# EAGLE design Down_Main_Board  (EAGLE 9.4.2)
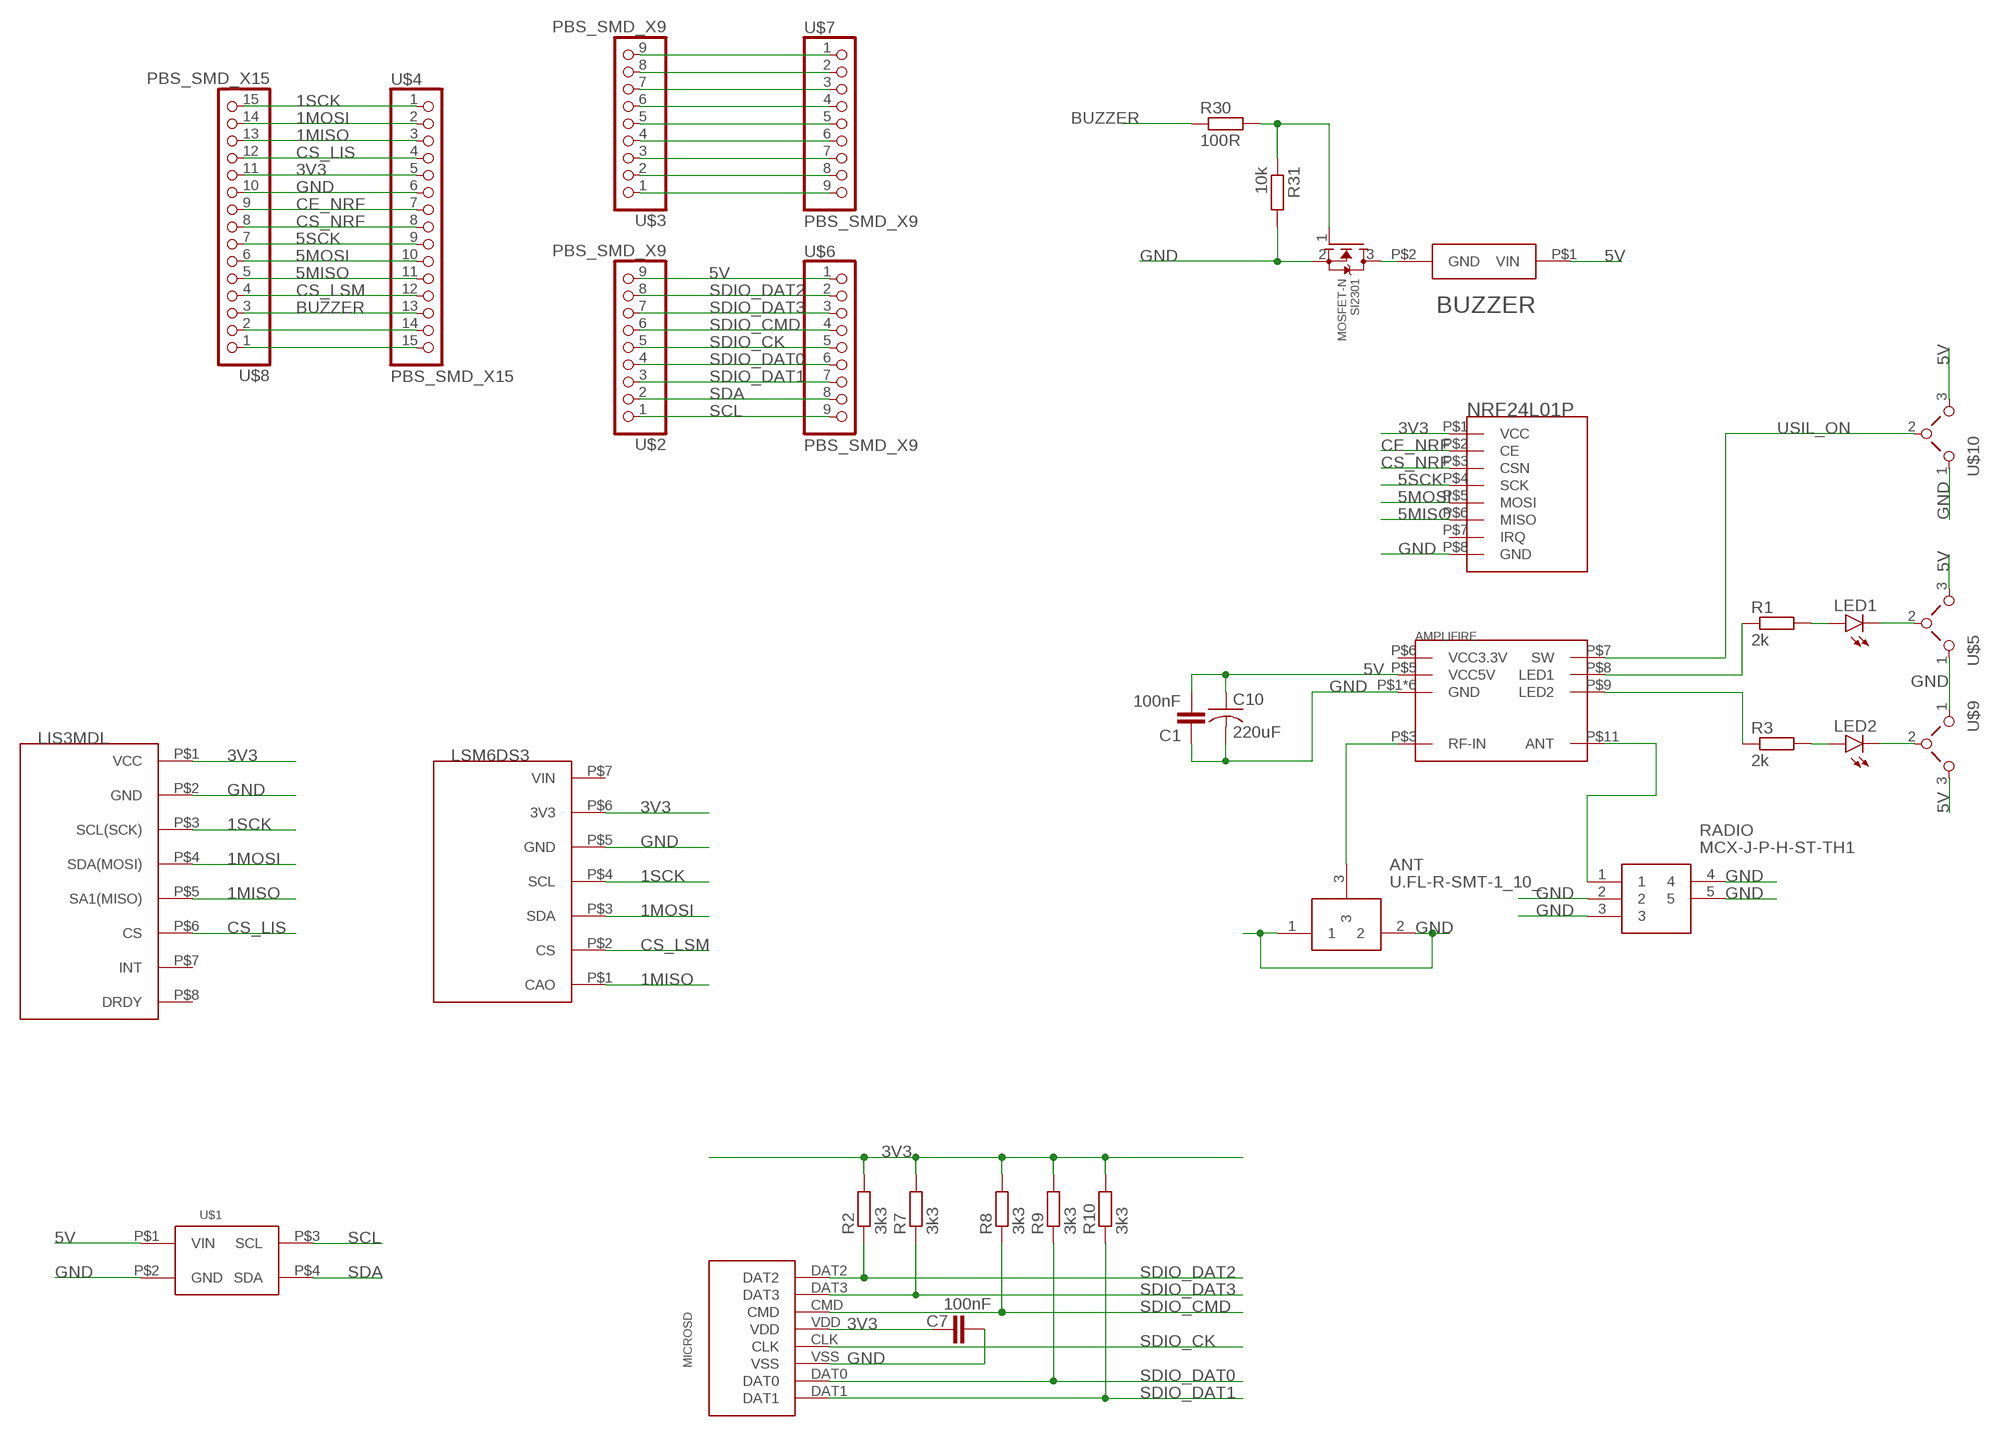
[diagram p0: schematic, sheet 1]

## Parts
AMPLIFIRE  XQ-02A  [XQ-02A]
ANT  U.FL-R-SMT-1_10_  [U.FL-R-SMT-1(10)]
BUZZER  BUZZERS8R6  [BUZZER-S8R12]
C1  100nF  C-EUC0603  [C0603]
C7  100nF  C-EUC0603  [C0603]
C10  220uF  ECAPECAP220  [ECAP220-CMD]
LED1  LEDCHIPLED_0603  [CHIPLED_0603]
LED2  LEDCHIPLED_0603  [CHIPLED_0603]
LIS3MDL  LIS3MDL-CJMCUбез_отв.  [LIS3MDL-CGMSU-NB2023-1]
LSM6DS3  LSM6DS3-GY-NB2023  [LSM6DS3-GY-NB2023]
MICROSD  SD  [SD]
NRF24L01P  NRF24L01_ML01SP4  [NRF24L01_ML01SP4]
R1  2k  R-EU_R0603  [R0603]
R2  3k3  R-EU_R0603  [R0603]
R3  2k  R-EU_R0603  [R0603]
R7  3k3  R-EU_R0603  [R0603]
R8  3k3  R-EU_R0603  [R0603]
R9  3k3  R-EU_R0603  [R0603]
R10  3k3  R-EU_R0603  [R0603]
R30  100R  R-EU_R0603  [R0603]
R31  10k  R-EU_R0603  [R0603]
RADIO  MCX-J-P-H-ST-TH1  [MCXJPHSTTH1]
SI2301  MOSFET-N  [SOT23-3]
U$1  BME280BME280-PINS-ONLY  [BME280-PINS-ONLY]
U$2  PBS_SMD_X9  [PBS_SMD_X9]
U$3  PBS_SMD_X9  [PBS_SMD_X9]
U$4  PBS_SMD_X15  [PBD_SMD_X15]
U$5  VIAS-SELECT  [VIAS-SELECT]
U$6  PBS_SMD_X9  [PBS_SMD_X9]
U$7  PBS_SMD_X9  [PBS_SMD_X9]
U$8  PBS_SMD_X15  [PBD_SMD_X15]
U$9  VIAS-SELECT  [VIAS-SELECT]
U$10  VIAS-SELECT  [VIAS-SELECT]

## Nets
1MISO: LIS3MDL.P$5(SA1(MISO)) LSM6DS3.P$1(CAO) U$4.3 U$8.13
1MOSI: LIS3MDL.P$4(SDA(MOSI)) LSM6DS3.P$3(SDA) U$4.2 U$8.14
1SCK: LIS3MDL.P$3(SCL(SCK)) LSM6DS3.P$4(SCL) U$4.1 U$8.15
3V3: C7.2 LIS3MDL.P$1(VCC) LSM6DS3.P$6(3V3) MICROSD.VDD NRF24L01P.P$1(VCC) R2.2 R7.2 R8.2 R9.2 R10.2 U$4.5 U$8.11
5MISO: NRF24L01P.P$6(MISO) U$4.11 U$8.5
5MOSI: NRF24L01P.P$5(MOSI) U$4.10 U$8.6
5SCK: NRF24L01P.P$4(SCK) U$4.9 U$8.7
5V: AMPLIFIRE.P$5(VCC5V) BUZZER.P$1(VIN) C1.2 C10.P$1 U$1.P$1(VIN) U$2.9 U$5.3(RIGHT) U$6.1 U$9.3(RIGHT) U$10.3(RIGHT)
BUZZER: R30.1 U$4.13 U$8.3
CE_NRF: NRF24L01P.P$2(CE) U$4.7 U$8.9
CS_LIS: LIS3MDL.P$6(CS) U$4.4 U$8.12
CS_LSM: LSM6DS3.P$2(CS) U$4.12 U$8.4
CS_NRF: NRF24L01P.P$3(CSN) U$4.8 U$8.8
GND: AMPLIFIRE.P$1(GND) AMPLIFIRE.P$2(GND) AMPLIFIRE.P$4(GND) AMPLIFIRE.P$10(GND) AMPLIFIRE.P$12(GND) AMPLIFIRE.P$13(GND) ANT.1 ANT.2 C1.1 C7.1 C10.P$2 LIS3MDL.P$2(GND) LSM6DS3.P$5(GND) MICROSD.VSS NRF24L01P.P$8(GND) R31.2 RADIO.2 RADIO.3 RADIO.4 RADIO.5 SI2301.2(S) U$1.P$2(GND) U$4.6 U$5.1(LEFT) U$8.10 U$9.1(LEFT) U$10.1(LEFT)
N$1: R30.2 R31.1 SI2301.1(G)
N$2: U$4.14 U$8.2
N$3: U$4.15 U$8.1
N$4: AMPLIFIRE.P$3(RF-IN) ANT.3
N$5: AMPLIFIRE.P$11(ANT) RADIO.1
N$6: U$3.8 U$7.2
N$7: U$3.7 U$7.3
N$8: U$3.6 U$7.4
N$9: U$3.5 U$7.5
N$10: U$3.4 U$7.6
N$11: U$3.3 U$7.7
N$12: U$3.9 U$7.1
N$14: U$3.2 U$7.8
N$15: U$3.1 U$7.9
N$16: LED1.C U$5.2(TOP)
N$17: LED1.A R1.2
N$18: AMPLIFIRE.P$8(LED1) R1.1
N$19: LED2.C U$9.2(TOP)
N$20: BUZZER.P$2(GND) SI2301.3(D)
N$21: LED2.A R3.2
N$22: AMPLIFIRE.P$9(LED2) R3.1
SCL: U$1.P$3(SCL) U$2.1 U$6.9
SDA: U$1.P$4(SDA) U$2.2 U$6.8
SDIO_CK: MICROSD.CLK U$2.5 U$6.5
SDIO_CMD: MICROSD.CMD R8.1 U$2.6 U$6.4
SDIO_DAT0: MICROSD.DAT0 R9.1 U$2.4 U$6.6
SDIO_DAT1: MICROSD.DAT1 R10.1 U$2.3 U$6.7
SDIO_DAT2: MICROSD.DAT2 R2.1 U$2.8 U$6.2
SDIO_DAT3: MICROSD.DAT3 R7.1 U$2.7 U$6.3
USIL_ON: AMPLIFIRE.P$7(SW) U$10.2(TOP)
Unconnected: AMPLIFIRE.P$6(VCC3.3V) LIS3MDL.P$7(INT) LIS3MDL.P$8(DRDY) LSM6DS3.P$7(VIN) NRF24L01P.P$7(IRQ)

## Library data of the parts
AMPLIFIRE = NEON-BLADE-2023:XQ-02A
ANT = U.FL-R-SMT-1_10_:U.FL-R-SMT-1_10_: UFL SMT PCB receptable,DC-6GHz Hirose Straight 50 Surface Mount UFL Connector, Receptacle, Solder Termination Coaxial Source: Datasheet <https://www.hirose.com/product/document?clcode=CL0331-0472-2-10&productname=U.FL-R-SMT-1(10)&series=U.FL&documenttype=2DDrawing&lang=en&documentid=0000940684>; ARROW_PART_NUMBER: U.FL-R-SMT-1(10); ARROW_PRICE-STOCK: https://www.arrow.com/en/products/u.fl-r-smt-1-10/hirose-electric; DESCRIPTION: UFL SMT PCB receptable,DC-6GHz Hirose Straight 50 Surface Mount UFL Connector, Receptacle, Solder Termination Coaxial; HEIGHT: mm; MANUFACTURER_NAME: Hirose; MANUFACTURER_PART_NUMBER: U.FL-R-SMT-1(10); MOUSER_PART_NUMBER: 798-U.FL-R-SMT-110; MOUSER_PRICE-STOCK: https://www.mouser.co.uk/ProductDetail/Hirose-Connector/U.FL-R-SMT-110?qs=kL1ClTr6oBoOdtqlGQpQrQ%3D%3D
BUZZER = NEON-BLADE-2023:BUZZER
C1 C7 = rcl:C-EU: CAPACITOR, European symbol; SPICEPREFIX: C
C10 = NEON-BLADE-2023:ECAP
LED1 LED2 = led:LED: LED OSRAM: - CHIPLED LG R971, LG N971, LY N971, LG Q971, LY Q971, LO R971, LY R971 LH N974, LH R974 LS Q976, LO Q976, LY Q976 LO Q996 - Hyper CHIPLED LW Q18S LB Q993, LB Q99A, LB R99A - SideLED LS A670, LO A670, LY A670, LG A670, LP A670 LB A673, LV A673, LT A673, LW A673 LH A674 LY A675 LS A676, LA A676, LO A676, LY A676, LW A676 LS A679, LY A679, LG A679 - Hyper Micro SIDELED® LS Y876, LA Y876, LO Y876, LY Y876 LT Y87S - SmartLED LW L88C, LW L88S LB L89C, LB L89S, LG L890 LS L89K, LO L89K, LY L89K LS L896, LA L896, LO L896, LY L896 - TOPLED LS T670, LO T670, LY T670, LG T670, LP T670 LSG T670, LSP T670, LSY T670, LOP T670, LYG T670 LG T671, LOG T671, LSG T671 LB T673, LV T673, LT T673, LW T673 LH T674 LS T676, LA T676, LO T676, LY T676, LB T676, LH T676, LSB T676, LW T676 LB T67C, LV T67C, LT T67C, LS T67K, LO T67K, LY T67K, LW E67C LS E67B, LA E67B, LO E67B, LY E67B, LB E67C, LV E67C, LT E67C LW T67C LS T679, LY T679, LG T679 LS T770, LO T770, LY T770, LG T770, LP T770 LB T773, LV T773, LT T773, LW T773 LH T774 LS E675, LA E675, LY E675, LS T675 LS T776, LA T776, LO T776, LY T776, LB T776 LHGB T686 LT T68C, LB T68C - Hyper Mini TOPLED® LB M676 - Mini TOPLED Santana® LG M470 LS M47K, LO M47K, LY M47K Source: http://www.osram.convergy.de LUXEON: - LUMILED® LXK2-PW12-R00, LXK2-PW12-S00, LXK2-PW14-U00, LXK2-PW14-V00 LXK2-PM12-R00, LXK2-PM12-S00, LXK2-PM14-U00 LXK2-PE12-Q00, LXK2-PE12-R00, LXK2-PE12-S00, LXK2-PE14-T00, LXK2-PE14-U00 LXK2-PB12-K00, LXK2-PB12-L00, LXK2-PB12-M00, LXK2-PB14-N00, LXK2-PB14-P00, LXK2-PB14-Q00 LXK2-PR12-L00, LXK2-PR12-M00, LXK2-PR14-Q00, LXK2-PR14-R00 LXK2-PD12-Q00, LXK2-PD12-R00, LXK2-PD12-S00 LXK2-PH12-R00, LXK2-PH12-S00 LXK2-PL12-P00, LXK2-PL12-Q00, LXK2-PL12-R00 Source: www.luxeon.com KINGBRIGHT: KA-3528ASYC Source: www.kingbright.com
LIS3MDL = NEON-BLADE-2023:LIS3MDL-CJMCU
LSM6DS3 = NEON-BLADE-2023:LSM6DS3-GY-NB2023
MICROSD = NEON-BLADE-2023:SD
NRF24L01P = NEON-BLADE-2023:NRF24L01_ML01SP4
R1-R3 R7-R10 R30 R31 = rcl:R-EU_: RESISTOR, European symbol; SPICEPREFIX: R
RADIO = MCX-J-P-H-ST-TH1:MCX-J-P-H-ST-TH1: Samtec MCXSeries, Through Hole MCX Jack jack, 50 Impedance, Solder Termination, 0 6GHz, Coaxial cable type Source: Datasheet <http://suddendocs.samtec.com/prints/mcx-j-p-x-st-th1-mkt.pdf>; ARROW_PART_NUMBER: MCX-J-P-H-ST-TH1; ARROW_PRICE-STOCK: https://www.arrow.com/en/products/mcx-j-p-h-st-th1/samtec?region=nac; DESCRIPTION: Samtec MCXSeries, Through Hole MCX Jack jack, 50 Impedance, Solder Termination, 0 6GHz, Coaxial cable type; HEIGHT: 5.81mm; MANUFACTURER_NAME: SAMTEC; MANUFACTURER_PART_NUMBER: MCX-J-P-H-ST-TH1; MOUSER_PART_NUMBER: 200-MCXJPHSTTH1; MOUSER_PRICE-STOCK: https://www.mouser.co.uk/ProductDetail/Samtec/MCX-J-P-H-ST-TH1?qs=Cqqh%252BS766wnNti0C6DXzpQ%3D%3D
SI2301 = NEON-BLADE-2023:MOSFET-N
U$1 = NEON-BLADE-2024:BME280
U$2 U$3 U$6 U$7 = NEON-BLADE-2024:PBS_SMD_X9
U$4 U$8 = NEON-BLADE-2024:PBS_SMD_X15
U$5 U$9 U$10 = NEON-BLADE-2024:VIAS-SELECT

## Board
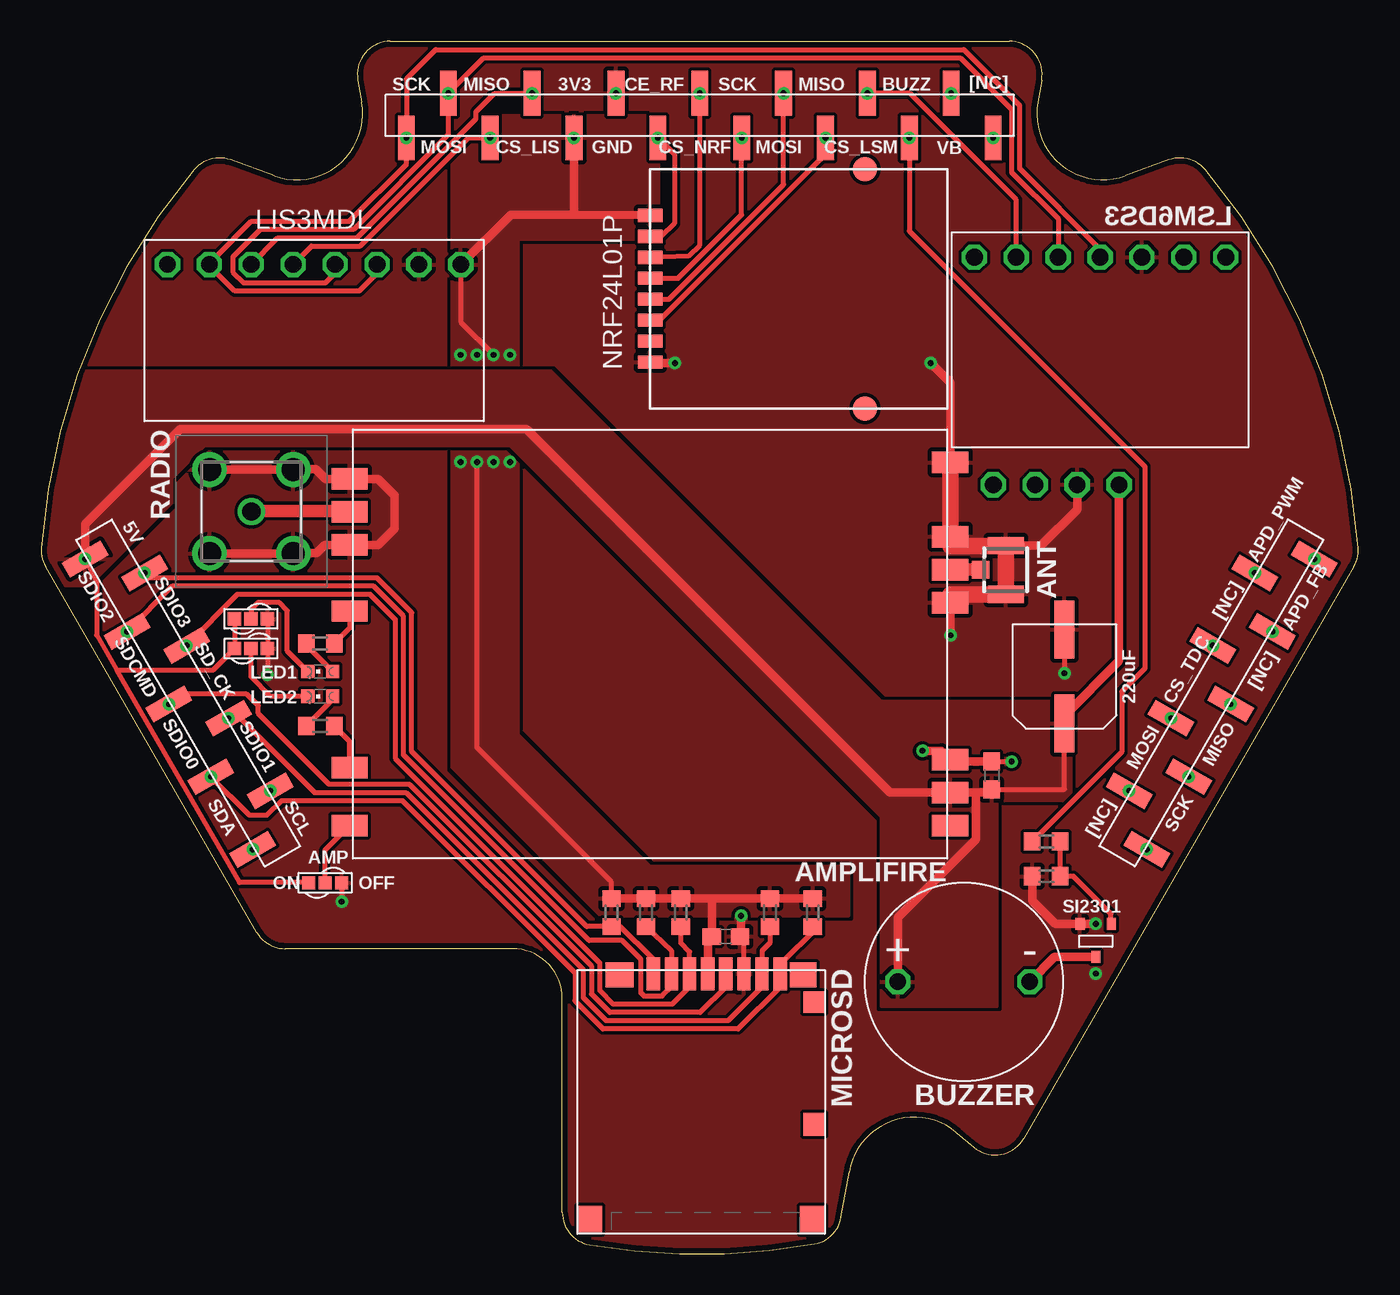
[diagram p1: board, top side]
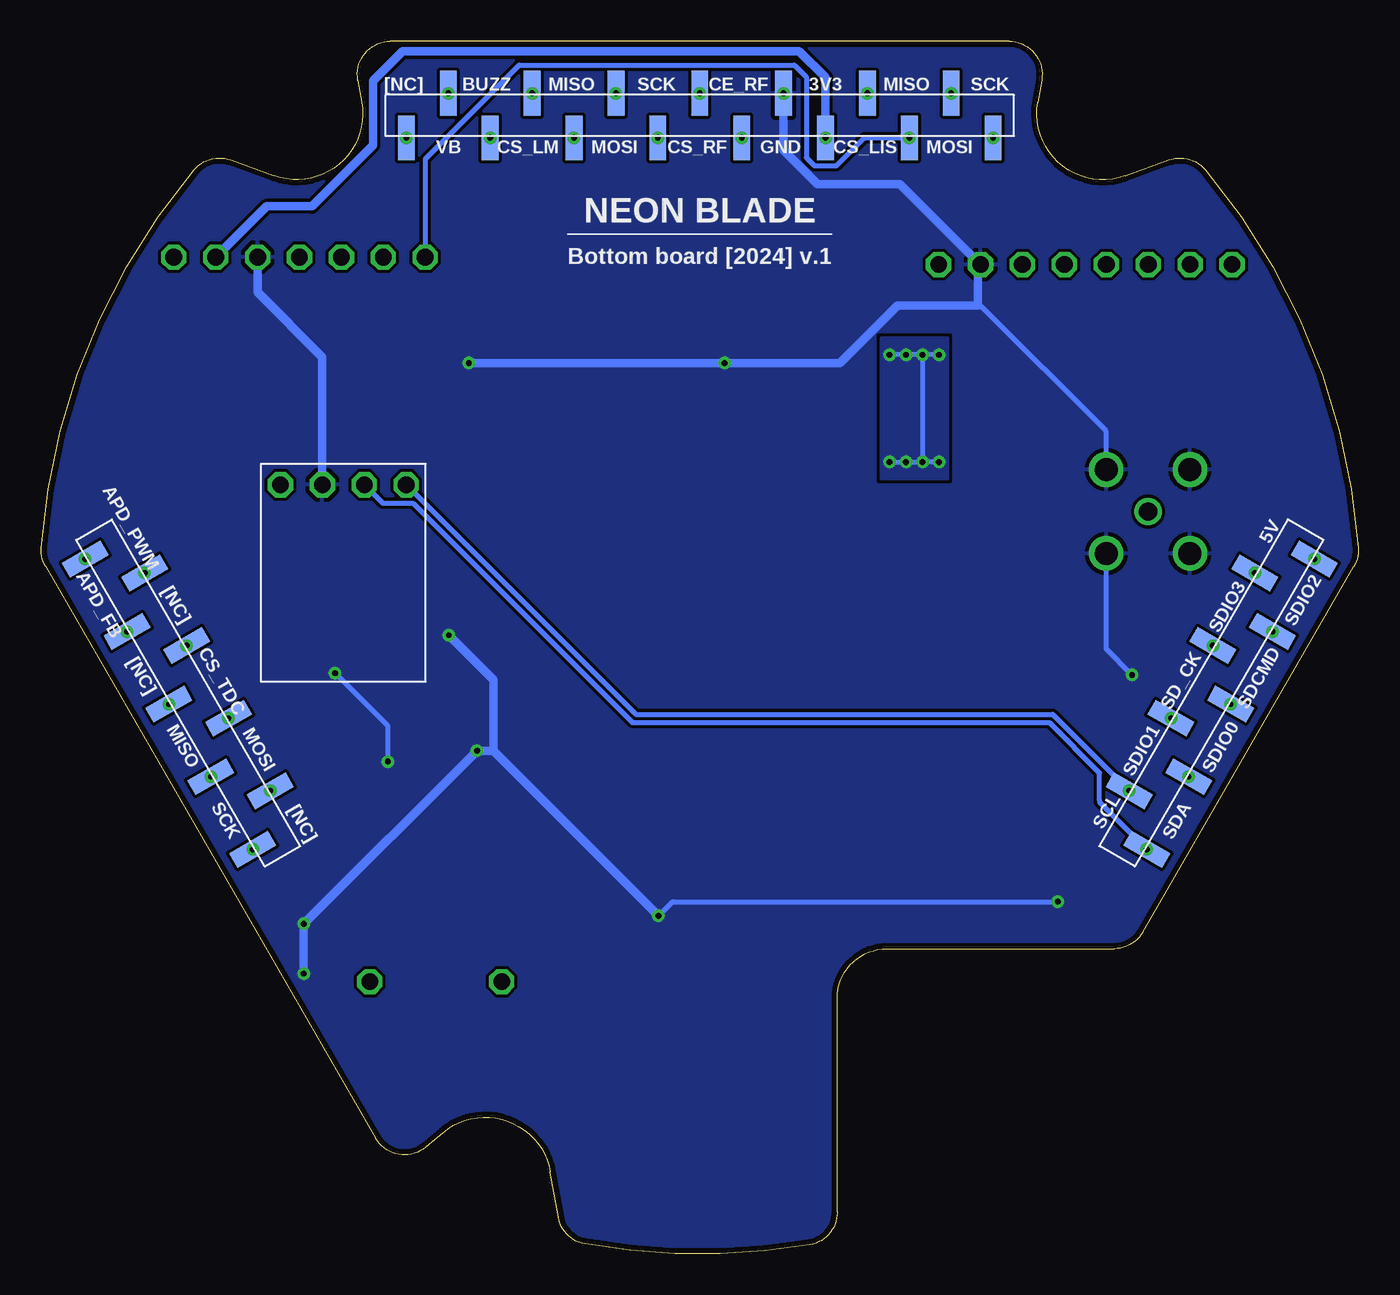
[diagram p2: board, bottom side, seen from below]

Size 79.81 x 73.48 mm. Coordinates in mm from the lower left corner, seen from the top.
Outline: 13.06,19.48 0.27,41.64 arc-34 0,42.78 arc-36 9.27,65.7 arc-70 11.48,66.29 14.11,65.33 arc120 19.42,69.79 19.18,71.13 arc-100 21.15,73.48 58.66,73.48 arc-100 60.63,71.13 60.39,69.79 arc120 65.7,65.33 68.33,66.29 arc-70 70.55,65.7 arc-36 79.81,42.78 arc-34 79.55,41.64 59.54,6.99 arc-100 56.52,6.46 55.47,7.34 arc120 48.96,4.97 48.48,2.21 arc-70 46.86,0.59 arc-20 33.24,0.54 arc-80 31.57,2.51 31.57,15.48 arc90 28.57,18.48 14.79,18.48 arc-60 13.06,19.48
Copper layers (1*16): Top 0.035mm / dielectric 1.5mm / Bottom 0.035mm
Design rules "default *": minimum track width 0.3mm, minimum drill 0.35mm, track to track 0.2mm, track to pad 0.2mm, pad to pad 0.2mm, via to via 0.2mm, smd to smd 0.2mm, copper to edge 0.35mm, drill to drill 0.00508125mm, minimum pad ring 10mil, minimum via ring 8mil, stop-mask expansion 4mil, vias tented up to drill 0mil, thermal gap 10mil

### Footprints (pad centres in the part's own frame; a part is rotated, then mirrored left to right if it is on the bottom)
XQ-02A = smd 2.2 x 1.3: P$1 -18.2,-11; P$2 -18.2,-6.5; P$3 -18.2,-4.5; P$4 -18.2,-2.5; P$5 -18.2,9; P$6 -18.2,11; P$7 18.2,11; P$8 18.2,7.5; P$9 18.2,-2; P$10 18.2,-6; P$11 18.2,-8; P$12 18.2,-10; P$13 -18.2,7
U.FL-R-SMT-1(10) = smd 1.05 x 2.2: 1 -1.475,0; 2 1.475,0 | smd 1.05 x 1.05: 3 0,1.525
BUZZER-S8R12 = drill 1 octagon: P$1 -4,0; P$2 4,0
C0603 = smd 1.1 x 1: 1 -0.85,0; 2 0.85,0
ECAP220-CMD = smd 1.2 x 3.5: P$1 0,2.85; P$2 0,-2.85
CHIPLED_0603 = smd 0.8 x 0.8: A 0,-0.75; C 0,0.75
LIS3MDL-CGMSU-NB2023-1 = drill 1.016 octagon: P$1 -8.89,-4; P$2 -6.35,-4; P$3 -3.81,-4; P$4 -1.27,-4; P$5 1.27,-4; P$6 3.81,-4; P$7 6.35,-4; P$8 8.89,-4
LSM6DS3-GY-NB2023 = drill 1.016 octagon: P$1 -7.62,-5; P$2 -5.08,-5; P$3 -2.54,-5; P$4 0,-5; P$5 2.54,-5; P$6 5.08,-5; P$7 7.62,-5
SD = smd 0.8 x 2: CLK 6,-15.77; CMD 8.2,-15.77; DAT0 3.8,-15.77; DAT1 2.7,-15.77; DAT2 10.4,-15.77; DAT3 9.3,-15.77; VDD 7.1,-15.77; VSS 4.9,-15.77 | smd 1.5 x 1.7: P$9 0.75,-0.85; P$13 14.25,-0.85 | smd 1.6 x 1.5: P$10 1.3,-15.7 | smd 1.29 x 1.3: P$11 0.645,-14.05 | smd 1.29 x 1.4: P$12 0.645,-6.65 | smd 1.7 x 1.5: P$14 12.45,-15.7
NRF24L01_ML01SP4 = smd 1.5 x 0.8: P$1 -9,4.445; P$2 -9,3.175; P$3 -9,1.905; P$4 -9,0.635; P$5 -9,-0.635; P$6 -9,-1.905; P$7 -9,-3.175; P$8 -9,-4.445 | smd 1.5 x 1.5: P$9 4,7.25; P$10 4,-7.25
R0603 = smd 1 x 1.1: 1 -0.85,0; 2 0.85,0
MCXJPHSTTH1 = drill 1.1 pad 1.65: 1 0,0 | drill 1.4 pad 2.1: 2 -2.54,2.54; 3 -2.54,-2.54; 4 2.54,-2.54; 5 2.54,2.54
SOT23-3 = smd 0.56 x 0.73: 1 -0.95,-1; 2 0.95,-1; 3 0,1
BME280-PINS-ONLY = drill 1.016 octagon: P$1 -3.81,5.33; P$2 -1.27,5.33; P$3 1.27,5.33; P$4 3.81,5.33
PBS_SMD_X9 = smd 1.02 x 2.7: 1 -10.16,1.35; 2 -7.62,-1.35; 3 -5.08,1.35; 4 -2.54,-1.35; 5 0,1.35; 6 2.54,-1.35; 7 5.08,1.35; 8 7.62,-1.35; 9 10.16,1.35
PBD_SMD_X15 = smd 1.02 x 2.7: 1 -17.78,1.35; 2 -15.24,-1.35; 3 -12.7,1.35; 4 -10.16,-1.35; 5 -7.62,1.35; 6 -5.08,-1.35; 7 -2.54,1.35; 8 0,-1.35; 9 2.54,1.35; 10 5.08,-1.35; 11 7.62,1.35; 12 10.16,-1.35; 13 12.7,1.35; 14 15.24,-1.35; 15 17.78,1.35
VIAS-SELECT = smd 0.8 x 0.8: 1 -0.5,0; 2 0.5,0; 3 1.5,0

### Placement (x,y rotation side)
AMPLIFIRE  36.89,36.95 180 top
ANT  58.46,41.44 90 top
BUZZER  55.91,16.48 0 top
C1  57.61,28.99 270 top
C7  41.49,19.23 180 top
C10  62.01,34.98 180 top
LED1  16.91,33.78 90 top
LED2  16.91,35.28 90 top
LIS3MDL  16.54,55.95 180 top
LSM6DS3  64.17,55.39 180 bottom
MICROSD  47.49,1.2 180 top
NRF24L01P  45.91,58.48 0 top
R1  16.91,31.98 180 top
R2  34.56,20.68 90 top
R3  16.91,36.98 180 top
R7  36.66,20.68 90 top
R8  38.76,20.68 90 top
R9  44.16,20.68 90 top
R10  46.76,20.68 90 top
R30  60.91,24.98 0 top
R31  60.91,22.88 180 top
RADIO  12.74,44.98 0 top
SI2301  63.91,18.98 180 top
U$1  61.51,41.27 0 bottom
U$2  8.91,33.98 120 top
U$3  70.91,33.98 240 top
U$4  39.91,68.98 180 bottom
U$5  13.21,36.68 180 top
U$6  8.91,33.98 240 bottom
U$7  70.91,33.98 120 bottom
U$8  39.91,68.98 180 top
U$9  13.21,38.48 180 top
U$10  17.71,22.48 180 top

### Tracks (layer width: path | path; a pad name or v marks a point on that pad's centre or on a via)
1MISO  (via drill 0.35)
  Top 0.3: U$8.13 25.91,67.63 19.34,61.06 16.38,61.06 LIS3MDL.P$5
  Bottom 0.3: LSM6DS3.P$1 56.55,66.34 50.86,72.03 34.17,72.03 33.45,71.31 33.45,66.44 32.94,65.93 31.63,65.93 29.93,67.63 U$8.13
  other vias: 27.21,67.63
1MOSI  (via drill 0.35)
  Top 0.3: LSM6DS3.P$3 61.63,62.72 58.81,65.54 58.81,69.37 55.7,72.48 26.82,72.48 U$8.14 24.67,67.81 18.92,62.06 13.27,62.06 11.61,60.41 11.61,59.49 12.27,58.84 17.23,58.84 17.81,59.42 LIS3MDL.P$4
  other vias: 24.67,70.33
1SCK  (via drill 0.35)
  Top 0.3: LSM6DS3.P$4 64.17,60.89 59.31,65.75 59.31,69.58 55.91,72.98 23.91,72.98 22.13,71.2 U$8.15 22.13,66.03 18.66,62.56 12.73,62.56 10.57,60.41 10.57,59.49 11.73,58.34 19.27,58.34 20.35,59.42 LIS3MDL.P$3
  other vias: 22.13,67.63
3V3  (via drill 0.35)
  Top 0.3: LIS3MDL.P$1 25.43,56.46 v27.41,54.48 | R2.2 34.56,22.53 26.41,30.68 v26.41,47.98
  Top 0.5: MICROSD.VDD 40.41,16.99 40.41,18.98 40.64,19.21 C7.2 40.64,21.26 arc-90 40.91,21.53 | LIS3MDL.P$1 28.46,62.99 32.29,62.99 | 32.29,62.99 NRF24L01P.P$1 | U$8.11 32.29,62.99 | R10.2 R9.2 40.91,21.53 | R2.2 R7.2 R8.2 40.91,21.53
  Bottom 0.3: v25.41,54.48 v26.41,54.48 | v28.41,54.48 v27.41,54.48 v26.41,54.48 | v25.41,47.98 v26.41,47.98 | v26.41,47.98 v27.41,47.98 v28.41,47.98 | v26.41,54.48 v26.41,47.98
  Bottom 0.5: LSM6DS3.P$6 66.16,63.48 63.41,63.48 59.71,67.18 59.71,71.08 57.91,72.88 33.88,72.88 32.29,71.29 U$8.11
  other vias: 32.29,67.63
  pour Top (rank 2): 24.91,61.48 28.91,61.48 28.91,31.48 36.91,23.48 48.91,23.48 48.91,20.48 33.91,20.48 24.91,29.48
  pour Bottom: 24.91,55.48 28.91,55.48 28.91,46.98 24.91,46.98
  pour Top (rank 2): 24.91,61.48 37.41,61.48 37.41,68.98 24.91,68.98
5MISO  (via drill 0.35)
  Top 0.3: U$8.5 47.53,66.63 37.47,56.58 NRF24L01P.P$6
  other vias: 47.53,67.63
5MOSI  (via drill 0.35)
  Top 0.3: NRF24L01P.P$5 38.03,57.85 44.99,64.8 U$8.6
  other vias: 44.99,70.33
5SCK  (via drill 0.35)
  Top 0.3: NRF24L01P.P$4 38.6,59.12 42.45,62.97 U$8.7
  other vias: 42.45,67.63
5V  (via drill 0.35)
  Top 0.3: U$9.3 U$5.3 11.71,36.66 10.41,35.36 4.59,35.36 | U$2.9 | 4.59,35.36 3.36,37.49 3.36,40.78 U$2.9 | 8.48,28.62 12.01,22.5 16.19,22.5 U$10.3 | 8.48,28.62 | 8.48,28.62 4.59,35.36 | C1.2 62.01,28.14 C10.P$1 61.99,32.59
  Top 0.5: 56.64,27.95 56.64,25.12 51.91,20.39 BUZZER.P$1 | 56.64,27.95 57.42,27.95 C1.2 | U$2.9 2.66,44.23 8.41,49.98 29.41,49.98 51.44,27.95 56.64,27.95 | U$1.P$1 65.32,35.91 61.99,32.59
  other vias: 2.66,42.11
  pour Top: -1.59,40.48 2.91,40.48 7.91,45.48 7.91,46.98 9.91,48.98 28.41,48.98 50.91,26.48 50.91,14.98 57.91,14.98 57.91,33.48 50.91,33.48 30.91,53.48 -1.59,53.48
  pour Top: 57.91,33.48 62.41,33.48 62.41,27.48 57.91,27.48
BUZZER  (via drill 0.35)
  Top 0.3: R30.1 65.48,30.41 65.48,34.07 66.89,35.48 66.89,47.7 52.61,61.98 U$8.3
  other vias: 52.61,67.63
CE_NRF  (via drill 0.35)
  Top 0.3: U$8.9 38.37,66.63 38.37,62.44 37.58,61.66 NRF24L01P.P$2
  other vias: 37.37,67.63
CS_LIS  (via drill 0.35)
  Top 0.3: U$8.12 27.48,70.33 26.35,69.2 26.35,68.78 19.13,61.56 14.34,61.56 LIS3MDL.P$6
  other vias: 29.75,70.33
CS_LSM  (via drill 0.35)
  Top 0.3: LSM6DS3.P$2 59.09,63.88 52.63,70.33 U$8.4
  other vias: 50.07,70.33
CS_NRF  (via drill 0.35)
  Top 0.3: NRF24L01P.P$3 39.27,60.49 39.91,61.13 U$8.8
  other vias: 39.91,70.33
GND  (via drill 0.35)
  Top 0.3: U$9.1 U$5.1 v13.71,35.08 | MICROSD.VSS 42.59,18.98 C7.1 | U$10.1 v18.21,21.33 | C1.1 v58.8,29.84 v58.81,29.83 | C10.P$2 v62.01,35.18
  Top 0.5: RADIO.3 RADIO.4 15.29,42.45 16.69,42.45 17.19,42.95 AMPLIFIRE.P$10 20.41,42.95 21.41,43.95 21.41,45.98 21.38,45.98 20.41,46.95 AMPLIFIRE.P$12 17.24,46.95 16.64,47.55 15.31,47.55 RADIO.5 RADIO.2 | AMPLIFIRE.P$1 55.09,52.8 v53.91,53.98 | v38.41,53.98 37.16,53.98 36.98,53.97 NRF24L01P.P$8 | R31.2 60.06,21.38 61.46,19.98 SI2301.2 62.96,19.99 v63.91,19.99 | C7.1 42.41,19.3 v42.41,20.48 | v53.41,30.48 54.56,30.48 AMPLIFIRE.P$13 55.2,29.84 C1.1 | v55.11,37.48 55.09,37.5 AMPLIFIRE.P$4 | U$1.P$2 62.78,45.1 60.59,42.92 ANT.2
  Top 1: AMPLIFIRE.P$4 55.09,39.95 ANT.1 ANT.2 58.44,42.9 55.09,42.9 AMPLIFIRE.P$2 AMPLIFIRE.P$1
  Bottom 0.3: v13.71,35.08 15.28,36.65 RADIO.4 | RADIO.5 15.28,49.84 22.89,57.46 23.04,57.46 | v42.41,20.48 41.56,21.33 v18.21,21.33 | v58.81,29.83 58.81,31.98 v62.01,35.18
  Bottom 0.5: v53.91,53.98 v38.41,53.98 31.41,53.98 27.93,57.46 23.04,57.46 23.04,59.8 LIS3MDL.P$2 27.77,64.83 32.78,64.83 34.83,66.88 U$8.10 | v42.41,20.48 52.41,30.48 | 52.41,30.48 v53.41,30.48 v63.91,19.98 | 52.41,30.48 52.41,34.78 v55.11,37.48 | v63.91,19.99 v63.91,19.98 | v63.91,19.98 v63.91,16.98 | LSM6DS3.P$5 66.71,58.28 62.78,54.35 U$1.P$2
  other vias: 34.83,70.33
  pour Top (rank 3): 1.41,78.48 83.41,78.48 83.41,75.98 83.41,-1.52 65.41,-1.52 -0.59,-1.52 -0.59,78.48
  pour Bottom (rank 2): -11.09,77.98 82.41,77.98 82.41,-5.52 -11.09,-5.52
N$1
  Top 0.3: SI2301.1 64.83,19.98 64.83,20.6 62.55,22.88 R31.1 R30.2
N$2  (via drill 0.35)
  other vias: 55.15,70.33
N$3  (via drill 0.35)
  other vias: 57.69,67.63
N$4
  Top 0.75: AMPLIFIRE.P$3 ANT.3
  Top 1: ANT.3
N$5
  Top 0.3: 18.69,45.01 AMPLIFIRE.P$11
  Top 0.75: 18.69,45.01 12.84,45.01
  Top 1: RADIO.1 12.84,45.01
N$6  (via drill 0.35)
  Bottom 0.3: U$3.8
  other vias: 65.93,28.06
N$7  (via drill 0.35)
  Top 0.3: U$3.7
  other vias: 69.54,28.91
N$8  (via drill 0.35)
  Bottom 0.3: U$3.6
  other vias: 68.47,32.46
N$9  (via drill 0.35)
  Top 0.3: U$3.5
  other vias: 72.08,33.31
N$10  (via drill 0.35)
  Top 0.3: U$3.4
  other vias: 71.01,36.86
N$11  (via drill 0.35)
  Top 0.3: U$3.3
  other vias: 74.62,37.71
N$12  (via drill 0.35)
  Top 0.3: U$7.1
  other vias: 67,24.51
N$14  (via drill 0.35)
  Top 0.3: U$3.2
  other vias: 73.55,41.26
N$15  (via drill 0.35)
  Top 0.3: U$3.1
  other vias: 77.16,42.11
N$16
  Top 0.3: LED1.C 13.91,33.78 12.71,34.98 U$5.2
N$17
  Top 0.3: R1.2 17.66,33.58 LED1.A
N$18
  Top 0.3: AMPLIFIRE.P$8 18.69,31.05 R1.1
N$19
  Top 0.3: LED2.C 14.91,36.53 14.91,38.98 14.43,39.46 13.11,39.46 12.71,39.06 U$9.2
N$20
  Top 0.5: SI2301.3 61.41,17.98 BUZZER.P$2
N$21
  Top 0.3: R3.2 16.06,36.88 LED2.A
N$22
  Top 0.3: AMPLIFIRE.P$9 18.69,37.91 R3.1
SCL  (via drill 0.35)
  Top 0.3: U$2.1
  Bottom 0.3: U$1.P$3 59.12,45.49 57.29,45.49 43.99,32.19 18.72,32.19 15.69,29.15 15.69,27.48 15.69,27.38 U$2.1
  other vias: 12.82,24.51
SDA  (via drill 0.35)
  Bottom 0.3: U$1.P$4 43.78,32.69 18.51,32.69 U$2.2 | U$2.2
  other vias: 13.89,28.06
SDIO_CK  (via drill 0.35)
  Top 0.3: MICROSD.CLK 41.49,16.18 39.93,14.62 34.46,14.62 33.34,15.74 33.34,17.43 22.32,28.45 17.44,28.45 13.15,32.75 13.15,33.22 12.42,33.95 8.38,33.95 U$2.5 | U$2.5
  other vias: 7.74,33.31
SDIO_CMD  (via drill 0.35)
  Top 0.3: R8.1 38.76,18.83 39.29,18.3 MICROSD.CMD 39.29,16.18 38.23,15.12 34.66,15.12 33.84,15.95 33.84,17.64 21.45,30.02 21.45,38.44 19.93,39.96 11.89,39.96 8.81,36.88 U$2.6
  Bottom 0.3: U$2.6
  other vias: 8.81,36.86
SDIO_DAT0  (via drill 0.35)
  Top 0.3: R9.1 44.16,18.83 43.69,18.36 MICROSD.DAT0 43.69,16.18 41.63,14.12 34.25,14.12 32.84,15.54 32.84,17.22 22.11,27.95 16.55,27.95 12.05,32.46 U$2.4 | U$2.4 | U$2.4
  other vias: 11.35,32.46
SDIO_DAT1  (via drill 0.35)
  Top 0.3: R10.1 46.76,19.52 45.04,17.8 45.04,17.22 MICROSD.DAT1 44.79,16.18 42.23,13.62 34.04,13.62 32.34,15.33 32.34,17.02 21.9,27.45 14.56,27.45 13.67,26.57 12.62,26.57 U$2.3
  Bottom 0.3: U$2.3
  other vias: 10.28,28.91
SDIO_DAT2  (via drill 0.35)
  Top 0.3: MICROSD.DAT2 37.09,17.86 35.07,19.83 R2.1 33.06,19.83 22.45,30.44 22.45,38.85 20.35,40.96 6.57,40.96 U$2.8 | U$2.8
  other vias: 6.27,41.26
SDIO_DAT3  (via drill 0.35)
  Top 0.3: R7.1 38.19,18.38 MICROSD.DAT3 38.19,16.18 37.63,15.62 36.52,15.62 36.34,15.81 36.34,17.84 35.2,18.98 33.2,18.98 21.95,30.23 21.95,38.65 20.14,40.46 7.95,40.46 U$2.7 | U$2.7 | U$2.7
  other vias: 5.2,37.71
USIL_ON
  Top 0.3: AMPLIFIRE.P$7 17.19,24.45 17.19,22.5 U$10.2

### Text on the board
tPlace: AMP | ON | OFF
bPlace: NEON BLADE | Bottom board [2024] v.1
tNames: SCK | MISO | 3V3 | CE_RF | SCK | MISO | BUZZ | [NC] | MOSI | CS_LIS | GND | CS_NRF | MOSI | CS_LSM | VB | 5V | APD_PWM | SDIO2 | SDIO3 | [NC] | APD_FB | SDСMD | SD_CK | [NC] | CS_TDC | SDIO0 | SDIO1 | MISO | MOSI | SDA | SCL | SCK | [NC]
bNames: SCK | MISO | 3V3 | CE_RF | SCK | MISO | BUZZ | [NC] | MOSI | CS_LIS | GND | CS_RF | MOSI | CS_LM | VB | APD_PWM | 5V | SDIO2 | SDIO3 | APD_FB | [NC] | SDСMD | SD_CK | CS_TDC | [NC] | SDIO0 | SDIO1 | MOSI | MISO | SDA | SCL | [NC] | SCK